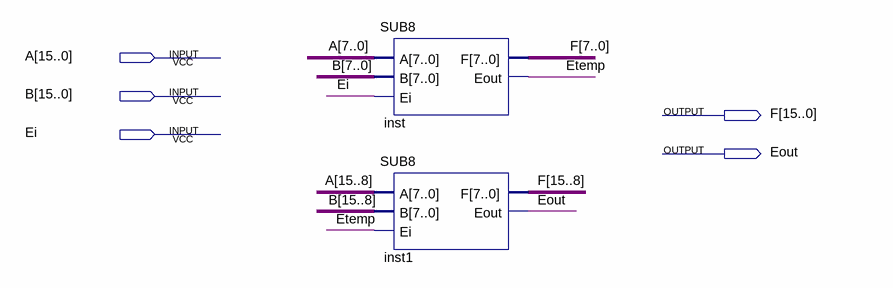
[diagram p0: schematic sheet]
// Quartus schematic SUB16.bdf as structural Verilog: 2 symbols, 5 pins
module SUB16 (
  input  [15:0] A,
  input  [15:0] B,
  input  Ei,
  output [15:0] F,
  output Eout
);

  wire Etemp;

  SUB8 inst (.A(A[7:0]), .B(B[7:0]), .Ei(Ei), .F(F[7:0]), .Eout(Etemp));
  SUB8 inst1 (.A(A[15:8]), .B(B[15:8]), .Ei(Etemp), .F(F[15:8]), .Eout(Eout));
endmodule
